# EAGLE board Masters Project (EAGLE 9.4.2)
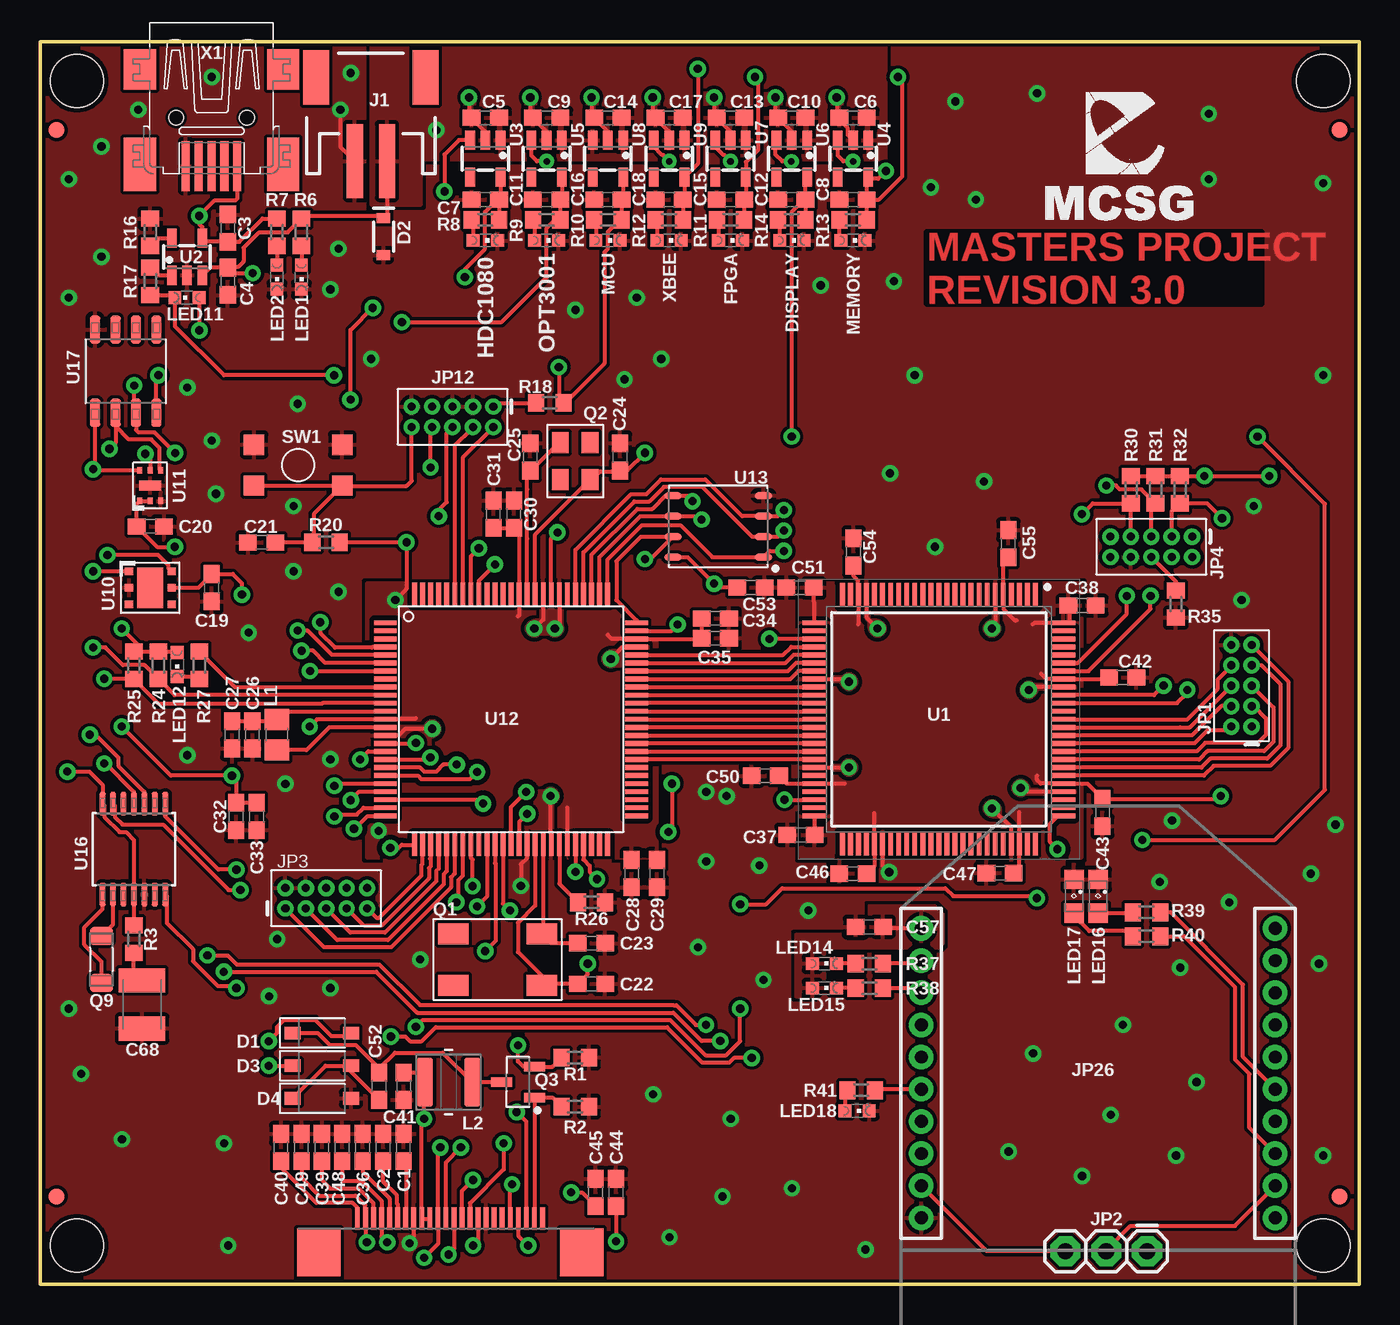
[diagram p35: board, top side]
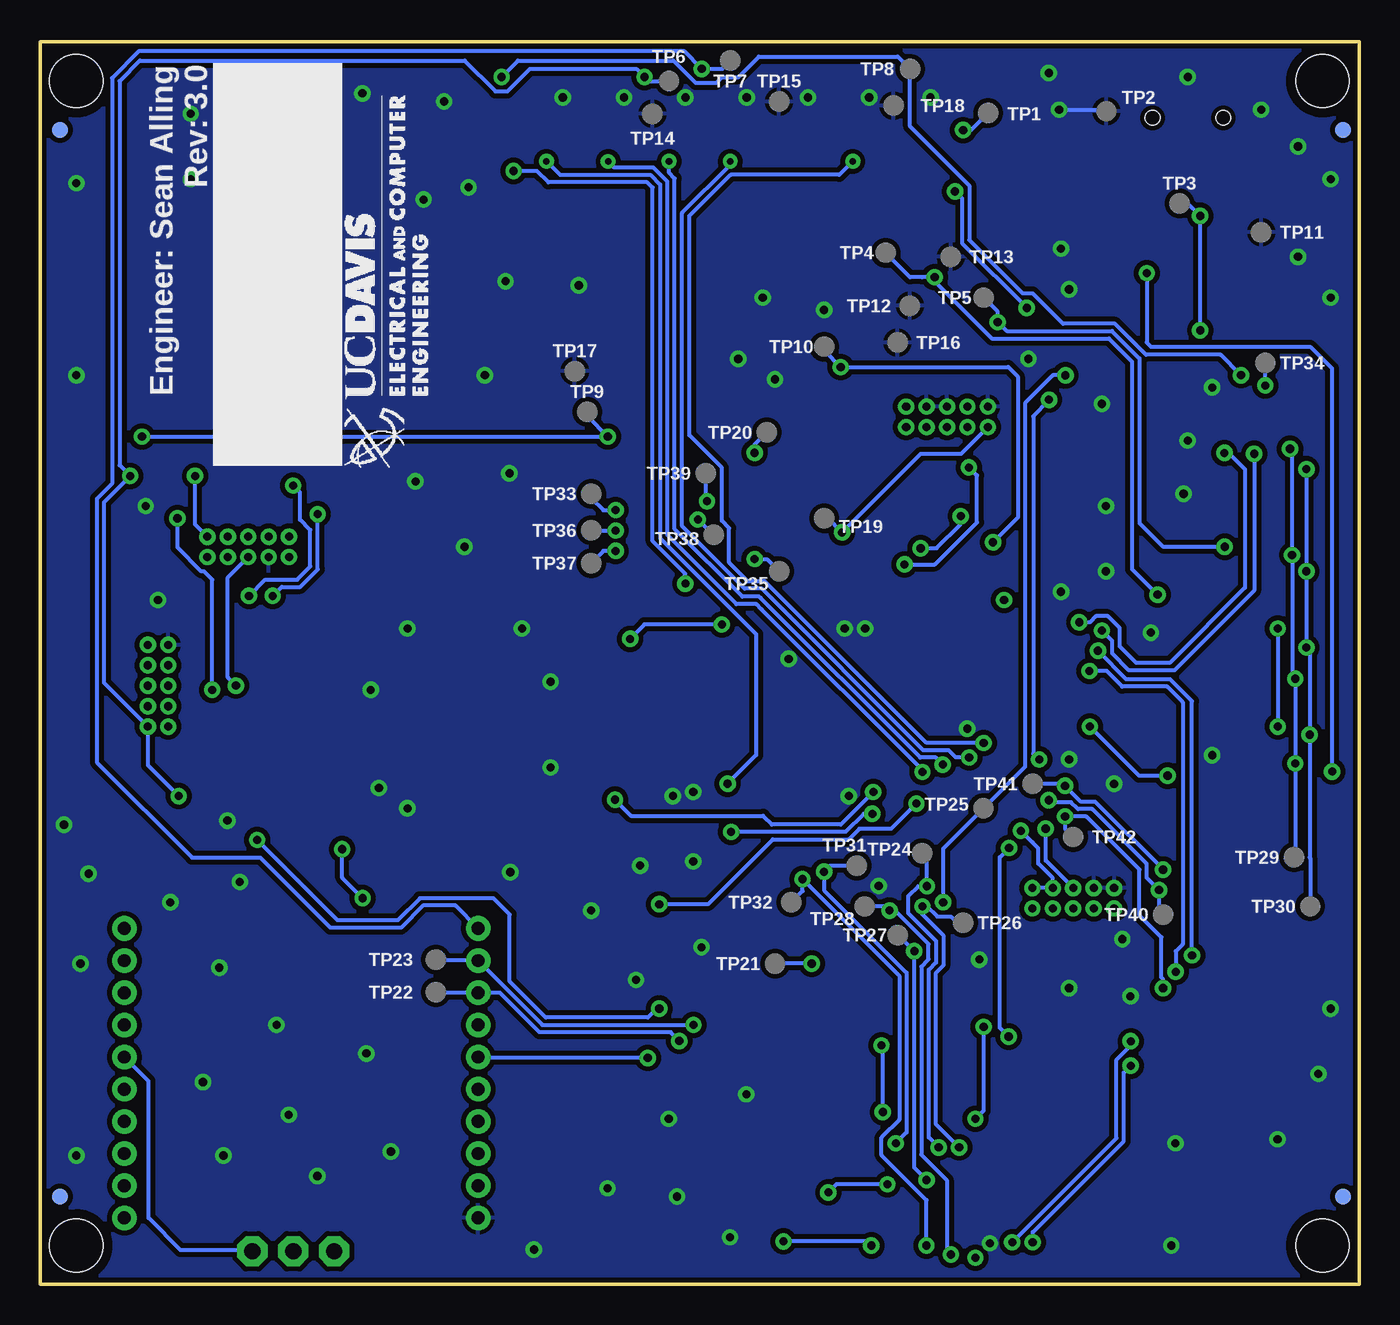
[diagram p36: board, bottom side, seen from below]

Size 82 x 77.25 mm. Coordinates in mm from the lower left corner, seen from the top.
Outline: 0,0 82,0 82,77.25 0,77.25 0,0
Copper layers (1*16): Top 0.035mm / dielectric 1.5mm / Bottom 0.035mm
Design rules "SparkFun-2-layer-STANDARD *": minimum track width 10mil, minimum drill 20mil, track to track 8mil, track to pad 8mil, pad to pad 8mil, via to via 10mil, smd to smd 8mil, copper to edge 8mil, drill to drill 8mil, minimum pad ring 10mil, minimum via ring 10mil, stop-mask expansion 4mil, vias tented up to drill 25mil, thermal gap 10mil

## Footprints (pad centres in the part's own frame; a part is rotated, then mirrored left to right if it is on the bottom)
C0603 = smd 1.1 x 1: 1 -0.85,0; 2 0.85,0
C1210K = smd 1.5 x 2.9: 1 -1.5,0; 2 1.5,0
SOD3716X128 = smd 1.004 x 0.789: 1 -1.808,0; 2 1.808,0
SOD-323 = smd 0.63 x 0.83: A 1.15,0; C -1.15,0
CHIPLED_0603 = smd 0.8 x 0.8: A 0,-0.75; C 0,0.75
FIDUCIAL-1X2 = smd 1 x 1: 1 0,0
STAND-OFF = hole 3.302: 0,0
JST-2-SMD = smd 1 x 4.6: 1 -1,-3.7; 2 1,-3.7 | smd 1.6 x 3.4: NC1 -3.4,1.5; NC2 3.4,1.5
CORTEX_DEBUG_10PIN = drill 0.508 pad 1: 1 -2.54,-0.635; 2 -2.54,0.635; 3 -1.27,-0.635; 4 -1.27,0.635; 5 0,-0.635; 6 0,0.635; 7 1.27,-0.635; 8 1.27,0.635; 9 2.54,-0.635; 10 2.54,0.635
1X3_FEMALE_HEADER_THROUGH_HOLE = drill 1.016 pad 1.88 octagon: 1 -2.54,0; 2 0,0; 3 2.54,0
XBEE-1 = drill 0.8 pad 1.524: 1 -11,20; 2 -11,18; 3 -11,16; 4 -11,14; 5 -11,12; 6 -11,10; 7 -11,8; 8 -11,6; 9 -11,4; 10 -11,2; 11 11,2; 12 11,4; 13 11,6; 14 11,8; 15 11,10; 16 11,12; 17 11,14; 18 11,16; 19 11,18; 20 11,20
L-USL0805 = smd 1.3 x 1.5: 1 -0.95,0; 2 0.95,0
LPS3015 = smd 1 x 3: 1 -1.475,0; 2 1.475,0
SML0805 = smd 1.2 x 1.2: A 1.05,0; C -1.05,0
CPFBZ-A2C4-32.768KD6 = smd 1.9 x 1.3: P$1 -2.75,1.6; P$2 2.75,1.6; P$3 2.75,-1.6; P$4 -2.75,-1.6
CRYSTAL_4-SMD = smd 1.3 x 1.05: P$1 -1.15,-0.925; P$2 1.15,-0.925; P$3 1.15,0.925; P$4 -1.15,0.925
SOT95P237X112-3 = smd 1.298 x 0.589: 1 -1.027,0.95; 2 -1.027,-0.95; 3 1.027,0
2-SMD = smd 1.11 x 1.43: 1 -1.46,0; 2 1.46,0
R0603 = smd 1 x 1.1: 1 -0.85,0; 2 0.85,0
7914G = smd 1.27 x 1.27: 1 -1.27,-2.54; 2 -1.27,2.946; 3 1.27,-2.54; 4 1.27,2.946
B1,27 = smd 1.27 x 1.27: TP 0,0
QFP50P1600X1600X160-100N = smd 1.475 x 0.3: 1 -7.738,6; 2 -7.738,5.5; 3 -7.738,5; 4 -7.738,4.5; 5 -7.738,4; 6 -7.738,3.5; 7 -7.738,3; 8 -7.738,2.5; 9 -7.738,2; 10 -7.738,1.5; 11 -7.738,1; 12 -7.738,0.5; 13 -7.738,0; 14 -7.738,-0.5; 15 -7.738,-1; 16 -7.738,-1.5; 17 -7.738,-2; 18 -7.738,-2.5; 19 -7.738,-3; 20 -7.738,-3.5; 21 -7.738,-4; 22 -7.738,-4.5; 23 -7.738,-5; 24 -7.738,-5.5; 25 -7.738,-6; 51 7.738,-6; 52 7.738,-5.5; 53 7.738,-5; 54 7.738,-4.5; 55 7.738,-4; 56 7.738,-3.5; 57 7.738,-3; 58 7.738,-2.5; 59 7.738,-2; 60 7.738,-1.5; 61 7.738,-1; 62 7.738,-0.5; 63 7.738,0; 64 7.738,0.5; 65 7.738,1; 66 7.738,1.5; 67 7.738,2; 68 7.738,2.5; 69 7.738,3; 70 7.738,3.5; 71 7.738,4; 72 7.738,4.5; 73 7.738,5; 74 7.738,5.5; 75 7.738,6 | smd 0.3 x 1.475: 26 -6,-7.738; 27 -5.5,-7.738; 28 -5,-7.738; 29 -4.5,-7.738; 30 -4,-7.738; 31 -3.5,-7.738; 32 -3,-7.738; 33 -2.5,-7.738; 34 -2,-7.738; 35 -1.5,-7.738; 36 -1,-7.738; 37 -0.5,-7.738; 38 0,-7.738; 39 0.5,-7.738; 40 1,-7.738; 41 1.5,-7.738; 42 2,-7.738; 43 2.5,-7.738; 44 3,-7.738; 45 3.5,-7.738; 46 4,-7.738; 47 4.5,-7.738; 48 5,-7.738; 49 5.5,-7.738; 50 6,-7.738; 76 6,7.738; 77 5.5,7.738; 78 5,7.738; 79 4.5,7.738; 80 4,7.738; 81 3.5,7.738; 82 3,7.738; 83 2.5,7.738; 84 2,7.738; 85 1.5,7.738; 86 1,7.738; 87 0.5,7.738; 88 0,7.738; 89 -0.5,7.738; 90 -1,7.738; 91 -1.5,7.738; 92 -2,7.738; 93 -2.5,7.738; 94 -3,7.738; 95 -3.5,7.738; 96 -4,7.738; 97 -4.5,7.738; 98 -5,7.738; 99 -5.5,7.738; 100 -6,7.738
SOT23-5L = smd 1.2 x 0.6: 1 -1.15,0.95; 2 -1.15,0; 3 -1.15,-0.95; 4 1.15,-0.95; 5 1.15,0.95
WSON-6 = smd 0.5 x 0.45: 1 -1.325,1.025; 2 -1.325,0; 3 -1.325,-1.025; 4 1.325,-1.025; 5 1.325,0; 6 1.325,1.025 | smd 1.6 x 2.5: 7 0,0
USON-6 = smd 0.35 x 0.3: 1 -0.95,0.65; 2 -0.95,0; 3 -0.95,-0.65; 4 0.95,-0.65; 5 0.95,0; 6 0.95,0.65 | smd 0.65 x 1.35: 7 0,0
LQFP100 = smd 1.4 x 0.3: 1 -7.8,6; 2 -7.8,5.5; 3 -7.8,5; 4 -7.8,4.5; 5 -7.8,4; 6 -7.8,3.5; 7 -7.8,3; 8 -7.8,2.5; 9 -7.8,2; 10 -7.8,1.5; 11 -7.8,1; 12 -7.8,0.5; 13 -7.8,0; 14 -7.8,-0.5; 15 -7.8,-1; 16 -7.8,-1.5; 17 -7.8,-2; 18 -7.8,-2.5; 19 -7.8,-3; 20 -7.8,-3.5; 21 -7.8,-4; 22 -7.8,-4.5; 23 -7.8,-5; 24 -7.8,-5.5; 25 -7.8,-6; 51 7.8,-6; 52 7.8,-5.5; 53 7.8,-5; 54 7.8,-4.5; 55 7.8,-4; 56 7.8,-3.5; 57 7.8,-3; 58 7.8,-2.5; 59 7.8,-2; 60 7.8,-1.5; 61 7.8,-1; 62 7.8,-0.5; 63 7.8,0; 64 7.8,0.5; 65 7.8,1; 66 7.8,1.5; 67 7.8,2; 68 7.8,2.5; 69 7.8,3; 70 7.8,3.5; 71 7.8,4; 72 7.8,4.5; 73 7.8,5; 74 7.8,5.5; 75 7.8,6 | smd 0.3 x 1.4: 26 -6,-7.8; 27 -5.5,-7.8; 28 -5,-7.8; 29 -4.5,-7.8; 30 -4,-7.8; 31 -3.5,-7.8; 32 -3,-7.8; 33 -2.5,-7.8; 34 -2,-7.8; 35 -1.5,-7.8; 36 -1,-7.8; 37 -0.5,-7.8; 38 0,-7.8; 39 0.5,-7.8; 40 1,-7.8; 41 1.5,-7.8; 42 2,-7.8; 43 2.5,-7.8; 44 3,-7.8; 45 3.5,-7.8; 46 4,-7.8; 47 4.5,-7.8; 48 5,-7.8; 49 5.5,-7.8; 50 6,-7.8; 76 6,7.8; 77 5.5,7.8; 78 5,7.8; 79 4.5,7.8; 80 4,7.8; 81 3.5,7.8; 82 3,7.8; 83 2.5,7.8; 84 2,7.8; 85 1.5,7.8; 86 1,7.8; 87 0.5,7.8; 88 0,7.8; 89 -0.5,7.8; 90 -1,7.8; 91 -1.5,7.8; 92 -2,7.8; 93 -2.5,7.8; 94 -3,7.8; 95 -3.5,7.8; 96 -4,7.8; 97 -4.5,7.8; 98 -5,7.8; 99 -5.5,7.8; 100 -6,7.8
SON127P600X500X60-8N = smd 1.099 x 0.442: 1 -2.815,1.905; 2 -2.815,0.635; 3 -2.815,-0.635; 4 -2.815,-1.905; 5 2.815,-1.905; 6 2.815,-0.635; 7 2.815,0.635; 8 2.815,1.905
TSSOP14 = smd 0.41 x 1.47: 1 -1.95,-2.82; 2 -1.3,-2.82; 3 -0.65,-2.82; 4 0,-2.82; 5 0.65,-2.82; 6 1.3,-2.82; 7 1.95,-2.82; 8 1.95,2.82; 9 1.3,2.82; 10 0.65,2.82; 11 0,2.82; 12 -0.65,2.82; 13 -1.3,2.82; 14 -1.95,2.82
FM24CL16B = smd 1.74 x 0.65: 1 -2.585,1.905; 2 -2.585,0.635; 3 -2.585,-0.635; 4 -2.585,-1.905; 5 2.585,-1.905; 6 2.585,-0.635; 7 2.585,0.635; 8 2.585,1.905
FPC-24PIN-0.5MM = smd 0.3 x 1.4: 1 5.75,0.75; 2 5.25,0.75; 3 4.75,0.75; 4 4.25,0.75; 5 3.75,0.75; 6 3.25,0.75; 7 2.75,0.75; 8 2.25,0.75; 9 1.75,0.75; 10 1.25,0.75; 11 0.75,0.75; 12 0.25,0.75; 13 -0.25,0.75; 14 -0.75,0.75; 15 -1.25,0.75; 16 -1.75,0.75; 17 -2.25,0.75; 18 -2.75,0.75; 19 -3.25,0.75; 20 -3.75,0.75; 21 -4.25,0.75; 22 -4.75,0.75; 23 -5.25,0.75; 24 -5.75,0.75 | smd 2.7 x 3: 51 -8.16,-1.34; 52 8.2,-1.34
32005-201 = smd 3.1 x 0.5: 1 3,1.6; 2 3,0.8; 3 3,0; 4 3,-0.8; 5 3,-1.6 | smd 2.5 x 2: M1 -3,-4.45; M2 -3,4.45 | smd 3.3 x 2: M3 2.9,4.45; M4 2.9,-4.45 | hole 0.9: 0,2.2; 0,-2.2

## Placement (x,y rotation side)
C1  1uF  [C0603]  22.59,8.51 90 top
C2  1uF  [C0603]  21.32,8.51 90 top
C3  4.7uF  [C0603]  11.67,65.66 90 top
C4  4.7uF  [C0603]  11.67,62.36 270 top
C5  1uF  [C0603]  27.67,72.52 180 top
C6  1uF  [C0603]  50.53,72.52 180 top
C7  1uF  [C0603]  27.67,67.44 180 top
C8  1uF  [C0603]  50.53,67.44 180 top
C9  1uF  [C0603]  31.48,72.52 180 top
C10  1uF  [C0603]  46.72,72.52 180 top
C11  1uF  [C0603]  31.48,67.44 180 top
C12  1uF  [C0603]  46.72,67.44 180 top
C13  1uF  [C0603]  42.91,72.52 180 top
C14  1uF  [C0603]  35.29,72.52 180 top
C15  1uF  [C0603]  42.91,67.44 180 top
C16  1uF  [C0603]  35.29,67.44 180 top
C17  1uF  [C0603]  39.1,72.52 180 top
C18  1uF  [C0603]  39.1,67.44 180 top
C19  0.1uF  [C0603]  10.65,43.31 270 top
C20  100nF  [C0603]  6.84,47.12 0 top
C21  1nF  [C0603]  13.77,46.13 180 top
C22  22pF  [C0603]  34.27,18.67 0 top
C23  22pF  [C0603]  34.27,21.21 0 top
C24  22pF  [C0603]  36.05,51.44 90 top
C25  22pF  [C0603]  30.46,51.44 90 top
C26  100nF  [C0603]  13.19,34.16 270 top
C27  4uF  [C0603]  11.92,34.16 270 top
C28  4.7uF  [C0603]  36.77,25.54 270 top
C29  100nF  [C0603]  38.33,25.54 270 top
C30  4.7uF  [C0603]  29.45,47.88 90 top
C31  100nF  [C0603]  28.18,47.88 90 top
C32  4.7uF  [C0603]  12.18,29.08 270 top
C33  100nF  [C0603]  13.45,29.08 270 top
C34  4.7uF  [C0603]  41.97,41.4 0 top
C35  100nF  [C0603]  41.97,40.17 0 top
C36  1uF  [C0603]  20.05,8.51 90 top
C37  0.1uF  [C0603]  47.29,27.95 180 top
C38  0.1uF  [C0603]  64.76,42.19 0 top
C39  1uF  [C0603]  17.51,8.51 90 top
C40  1uF  [C0603]  14.97,8.51 90 top
C41  1uF  [C0603]  22.59,12.32 270 top
C42  0.1uF  [C0603]  67.29,37.72 0 top
C43  0.1uF  [C0603]  66.04,29.34 270 top
C44  1uF  [C0603]  35.8,5.71 90 top
C45  1uF  [C0603]  34.53,5.71 90 top
C46  0.1uF  [C0603]  50.52,25.53 180 top
C47  0.1uF  [C0603]  59.66,25.56 180 top
C48  1uF  [C0603]  18.78,8.51 90 top
C49  1uF  [C0603]  16.24,8.51 90 top
C50  0.1uF  [C0603]  45.08,31.62 180 top
C51  0.1uF  [C0603]  47.23,43.31 180 top
C52  1uF  [C0603]  21.07,12.32 270 top
C53  1uF  [C0603]  44.18,43.31 0 top
C54  0.1uF  [C0603]  50.57,45.53 90 top
C55  0.1uF  [C0603]  60.19,46.04 90 top
C57  47uF  [C0603]  51.55,22.22 180 top
C68  11mF  [C1210K]  6.33,17.4 270 top
D1  SCHOTTKY  [SOD3716X128]  17.51,15.62 0 top
D2  250mA/100V  [SOD-323]  21.34,65.13 270 top
D3  SCHOTTKY  [SOD3716X128]  17.51,13.59 0 top
D4  SCHOTTKY  [SOD3716X128]  17.51,11.56 0 top
DISPLAY  GREEN  [CHIPLED_0603]  46.72,64.9 270 top
FD1  FIDUCIAL1X2  [FIDUCIAL-1X2]  1.02,5.46 0 top
FD2  FIDUCIAL1X2  [FIDUCIAL-1X2]  1.02,71.75 0 top
FD3  FIDUCIAL1X2  [FIDUCIAL-1X2]  80.77,5.46 0 top
FD4  FIDUCIAL1X2  [FIDUCIAL-1X2]  80.77,71.75 0 top
FD5  FIDUCIAL1X2  [FIDUCIAL-1X2]  1.02,5.46 0 bottom
FD6  FIDUCIAL1X2  [FIDUCIAL-1X2]  1.02,71.75 0 bottom
FD7  FIDUCIAL1X2  [FIDUCIAL-1X2]  80.77,5.46 0 bottom
FD8  FIDUCIAL1X2  [FIDUCIAL-1X2]  80.77,71.75 0 bottom
FPGA  GREEN  [CHIPLED_0603]  42.91,64.9 270 top
H1  STAND-OFF  [STAND-OFF]  2.29,74.8 0 top
H2  STAND-OFF  [STAND-OFF]  79.76,74.8 0 top
H3  STAND-OFF  [STAND-OFF]  79.76,2.41 0 top
H4  STAND-OFF  [STAND-OFF]  2.29,2.41 0 top
HDC1080  GREEN  [CHIPLED_0603]  27.67,64.9 270 top
J1  [JST-2-SMD]  20.56,73.53 0 top
JP1  2X5_HEADER1.27MM  [CORTEX_DEBUG_10PIN]  74.68,37.21 90 top
JP2  1X3_HEADER  [1X3_FEMALE_HEADER_THROUGH_HOLE]  66.27,2.06 180 top
JP3  2X5_HEADER1.27MM  [CORTEX_DEBUG_10PIN]  17.78,24 0 top
JP4  2X5_HEADER1.27MM  [CORTEX_DEBUG_10PIN]  69.07,45.85 180 top
JP12  CORTEX_DEBUG_10PIN  [CORTEX_DEBUG_10PIN]  25.63,53.93 180 top
JP26  [XBEE-1]  65.77,2.13 0 top
L1  4.7uH  [L-USL0805]  14.72,34.16 90 top
L2  100uH  [LPS3015]  25.38,12.57 180 top
LED1  GREEN  [CHIPLED_0603]  16.24,62.61 180 top
LED2  GREEN  [CHIPLED_0603]  14.72,62.61 180 top
LED11  RED  [CHIPLED_0603]  9.13,61.34 90 top
LED12  GREEN  [CHIPLED_0603]  8.51,38.54 180 top
LED14  GREEN  [CHIPLED_0603]  48.75,19.94 270 top
LED15  GREEN  [CHIPLED_0603]  48.75,18.41 270 top
LED16  GREEN  [SML0805]  65.77,24.13 270 top
LED17  GREEN  [SML0805]  64.27,24.13 270 top
LED18  GREEN  [CHIPLED_0603]  50.78,10.79 270 top
MCU  GREEN  [CHIPLED_0603]  35.29,64.9 270 top
MEMORY  GREEN  [CHIPLED_0603]  50.53,64.9 270 top
OPT3001  GREEN  [CHIPLED_0603]  31.48,64.9 270 top
Q1  CPFBZ-A2C4-32.768KD6  [CPFBZ-A2C4-32.768KD6]  28.43,20.19 180 top
Q2  ABM8-48.000MHZ-B2-T  [CRYSTAL_4-SMD]  33.26,51.18 90 top
Q3  MOSFET-NCH  [SOT95P237X112-3]  29.7,12.57 180 top
Q9  ABS07-LR  [2-SMD]  3.79,20.19 270 top
R1  0.47  [R0603]  33.26,14.1 180 top
R2  100k  [R0603]  33.26,11.05 180 top
R3  1K  [R0603]  5.83,21.46 90 top
R6  330  [R0603]  16.24,65.41 90 top
R7  330  [R0603]  14.72,65.41 90 top
R8  330  [R0603]  27.67,66.17 0 top
R9  330  [R0603]  31.48,66.17 0 top
R10  330  [R0603]  35.29,66.17 0 top
R11  330  [R0603]  42.91,66.17 0 top
R12  330  [R0603]  39.1,66.17 0 top
R13  330  [R0603]  50.53,66.17 0 top
R14  330  [R0603]  46.72,66.17 0 top
R16  2K  [R0603]  6.84,65.41 90 top
R17  330R  [R0603]  6.84,62.36 90 top
R18  1K  [R0603]  31.68,54.8 180 top
R20  1K  [R0603]  17.77,46.13 180 top
R24  10K  [R0603]  7.35,38.48 90 top
R25  10K  [R0603]  5.83,38.48 90 top
R26  91k  [R0603]  34.27,23.75 180 top
R27  1K  [R0603]  9.89,38.48 90 top
R30  5k  [R0603]  67.8,49.4 90 top
R31  5k  [R0603]  69.33,49.4 90 top
R32  5k  [R0603]  70.85,49.4 90 top
R35  2k  [R0603]  70.6,42.29 90 top
R37  1K  [R0603]  51.55,19.94 180 top
R38  1K  [R0603]  51.55,18.41 180 top
R39  1K  [R0603]  68.77,23.13 180 top
R40  1K  [R0603]  68.77,21.63 180 top
R41  1K  [R0603]  51.04,12.07 180 top
SW1  TACTILE-SWITCH-SMT  [7914G]  16.24,50.93 90 top
TP1  TPB1,27  [B1,27]  23.07,72.81 0 bottom
TP2  TPB1,27  [B1,27]  15.72,72.93 0 bottom
TP3  TPB1,27  [B1,27]  11.18,67.18 0 bottom
TP4  TPB1,27  [B1,27]  29.45,64.13 90 bottom
TP5  TPB1,27  [B1,27]  23.35,61.34 90 bottom
TP6  TPB1,27  [B1,27]  42.91,74.8 90 bottom
TP7  TPB1,27  [B1,27]  39.1,76.07 90 bottom
TP8  TPB1,27  [B1,27]  27.92,75.56 90 bottom
TP9  TPB1,27  [B1,27]  47.99,54.23 90 bottom
TP10  TPB1,27  [B1,27]  33.26,58.29 90 bottom
TP11  TPB1,27  [B1,27]  6.1,65.41 0 bottom
TP12  TPB1,27  [B1,27]  27.94,60.83 0 bottom
TP13  TPB1,27  [B1,27]  25.4,63.88 0 bottom
TP14  TPB1,27  [B1,27]  43.94,72.77 0 bottom
TP15  TPB1,27  [B1,27]  36.07,73.53 0 bottom
TP16  TPB1,27  [B1,27]  28.7,58.55 0 bottom
TP17  TPB1,27  [B1,27]  48.77,56.77 0 bottom
TP18  TPB1,27  [B1,27]  28.96,73.28 0 bottom
TP19  TPB1,27  [B1,27]  33.27,47.62 0 bottom
TP20  TPB1,27  [B1,27]  36.83,52.96 0 bottom
TP21  TPB1,27  [B1,27]  36.32,19.94 0 bottom
TP22  TPB1,27  [B1,27]  57.4,18.16 0 bottom
TP23  TPB1,27  [B1,27]  57.4,20.19 0 bottom
TP24  TPB1,27  [B1,27]  27.18,26.8 0 bottom
TP25  TPB1,27  [B1,27]  23.37,29.59 0 bottom
TP26  TPB1,27  [B1,27]  24.64,22.48 0 bottom
TP27  TPB1,27  [B1,27]  28.7,21.72 0 bottom
TP28  TPB1,27  [B1,27]  30.73,23.49 0 bottom
TP29  TPB1,27  [B1,27]  4.06,26.54 0 bottom
TP30  TPB1,27  [B1,27]  3.05,23.49 0 bottom
TP31  TPB1,27  [B1,27]  31.24,26.04 0 bottom
TP32  TPB1,27  [B1,27]  35.31,23.75 0 bottom
TP33  TPB1,27  [B1,27]  47.75,49.15 180 bottom
TP34  TPB1,27  [B1,27]  5.84,57.28 0 bottom
TP35  TPB1,27  [B1,27]  36.07,44.32 0 bottom
TP36  TPB1,27  [B1,27]  47.75,46.86 180 bottom
TP37  TPB1,27  [B1,27]  47.75,44.83 0 bottom
TP38  TPB1,27  [B1,27]  40.13,46.61 90 bottom
TP39  TPB1,27  [B1,27]  40.64,50.42 90 bottom
TP40  TPB1,27  [B1,27]  12.19,22.99 0 bottom
TP41  TPB1,27  [B1,27]  20.32,31.11 0 bottom
TP42  TPB1,27  [B1,27]  17.78,27.81 0 bottom
U1  LCMXO2-640HC-4TG100C-NEW  [QFP50P1600X1600X160-100N]  55.86,35.13 270 top
U2  MCP73831  [SOT23-5L]  9.13,63.88 90 top
U3  STLQ015M33R  [SOT23-5L]  27.67,69.98 270 top
U4  STLQ015M33R  [SOT23-5L]  50.53,69.98 270 top
U5  STLQ015M33R  [SOT23-5L]  31.48,69.98 270 top
U6  STLQ015M33R  [SOT23-5L]  46.72,69.98 270 top
U7  STLQ015M12R  [SOT23-5L]  42.91,69.98 270 top
U8  STLQ015M33R  [SOT23-5L]  35.29,69.98 270 top
U9  STLQ015M33R  [SOT23-5L]  39.1,69.98 270 top
U10  HDC1080  [WSON-6]  6.84,43.31 0 top
U11  OPT3001  [USON-6]  6.84,49.66 90 top
U12  MSP432P401R  [LQFP100]  29.27,35.13 0 top
U13  AT25SL128A  [SON127P600X500X60-8N]  42.15,47.12 180 top
U16  PCF8523  [TSSOP14]  5.83,27.05 0 top
U17  FM24CL16B  [FM24CL16B]  5.32,56.77 270 top
U18  4.2-E-INK-DISPLAY  [FPC-24PIN-0.5MM]  25.47,3.33 0 top
U$1  [UC_DAVIS_EE_1.00_INCH]  57.9,50.93 90 bottom
U$2  [UC_DAVIS_ENG]  64.77,68.71 0 top
U$3  [MCSG_SMALL]  62.48,66.17 0 top
X1  MINI-USB-32005-201  [32005-201]  10.65,72.52 270 top
XBEE  GREEN  [CHIPLED_0603]  39.1,64.9 270 top

## Tracks (layer width: path | path; a pad name or v marks a point on that pad's centre or on a via)
!FLASH_HOLD  (via drill 0.51)
  Top 0.254: U12.75 37.07,41.27 35.81,42.53 35.81,44.96 37.33,46.48 U13.7 37.94,45.09 v37.59,45.09
  Bottom 0.254: v37.59,45.09 36.83,45.09 TP35.TP
!FLASH_WP  (via drill 0.51)
  Top 0.254: v46.23,48.13 45.85,47.75 U13.3 43.63,47.75 41.35,50.03 38.59,50.03 37.68,49.12 36.74,49.12 33.27,45.65 U12.80
  Bottom 0.254: TP33.TP 47.75,48.9 46.99,48.13 v46.23,48.13
!RST  (via drill 0.51)
  Top 0.254: SW1.1 17,47.88 17,46.21 R20.2 C21.1 | JP12.10 23.09,49.95 22.77,49.63 18.81,49.63 SW1.1 | SW1.2 SW1.1 | U12.83 31.77,46.36 v32.15,46.74
  Bottom 0.254: JP12.10 24.75,51.63 27.27,51.63 v32.15,46.74 33.03,47.62 TP19.TP
!RTC_INT1  (via drill 0.51)
  Top 0.254: U16.13 4.64,29.76 4.64,29.06 5.12,28.57 7.64,28.57 11.7,24.51 v12.45,24.51 | v19.3,30.1 19.83,30.63 U12.22
  Bottom 0.254: TP40.TP 12.45,23.24 v12.45,24.51 13.21,25.27 13.21,26.15 16.6,29.54 17.49,29.54 17.92,29.97 19.18,29.97 v19.3,30.1
!RTC_INT2  (via drill 0.51)
  Top 0.254: U12.24 20.09,29.63 19.67,29.21 18.41,29.21 v18.29,29.08 | U16.7 7.87,24.13 7.87,22.48 9.51,20.84 9.51,20.08 11.05,18.54 12.06,18.54 v12.19,18.41
  Bottom 0.254: TP42.TP 18.29,28.32 v18.29,29.08 16.97,29.08 13.66,25.78 13.66,22.94 12.3,21.57 12.3,19.06 12.19,18.95 v12.19,18.41
+BAT  (via drill 0.51)
  Top 0.254: U2.3 10.55,63.21 C4.1 | C4.1 11.71,63.25 12.3,63.25 12.64,63.58 12.64,64.43 13.61,65.41 15.39,65.41 R6.2 16.41,66.42 21.2,66.42 D2.C 21.56,66.51 J1.2 | C4.1 12.01,62.87 v13.21,62.87 | v1.69,31.88 3.05,31.88 3.88,31.05 U16.14 3.99,29.76 3.99,29.06 4.93,28.12 5.33,28.12 5.83,27.63 U16.4 R3.2
  Bottom 0.254: TP1.TP 24.13,71.75 v24.62,71.75 | v1.69,31.88 1.69,56.93 3.05,58.29 12.95,58.29 13.21,58.55 v13.21,62.87
  pour Top: 20.58,79.12 20.58,67.13 23.67,67.13 23.67,69.93 52.56,69.95 52.58,79.12
ASSOCIATE_LED
  Top 0.254: R39.1 70.27,23.13 74.77,18.63 74.77,14.13 JP26.15
CHARGE_STATUS  (via drill 0.51)
  Top 0.254: R17.1 8.21,61.51 LED11.C 8.38,59.55 11.42,56.51 v18.27,56.51 | v25.86,23.75 25.99,23.88 25.99,25.12 26.27,25.4 U12.32
  Bottom 0.254: v18.27,56.51 19.04,56.51 20.78,54.77 20.78,33 20.78,32.18 TP25.TP 25.86,27.09 v25.86,23.75
DISPLAY_D/!C  (via drill 0.51)
  Top 0.254: U12.36 28.27,26.2 28.31,26.15 28.31,21.36 v27.66,20.71 | U18.11 26.22,5.8 v26.9,6.48
  Bottom 0.254: v26.9,6.48 27.68,7.26 27.68,20.69 v27.66,20.71 28.67,21.72 TP27.TP
EINK_!RST  (via drill 0.51)
  Top 0.254: U12.46 v33.27,25.64 | U18.10 26.72,5.04 28.81,7.14 v28.81,8.76
  Bottom 0.254: v28.81,8.76 28.14,9.44 28.14,19.37 33.27,24.5 v33.27,25.64 32.88,26.04 TP31.TP
EINK_BUSY  (via drill 0.51)
  Top 0.254: U18.9 27.22,2.72 v26.91,2.41 | U12.47 33.77,26.4 34.16,26.01 34.16,25.64 v34.61,25.19
  Bottom 0.254: v26.91,2.41 26.91,5.23 29.7,8.03 29.7,9.13 28.6,10.24 28.6,19.18 v34.61,25.19 34.61,24.44 TP32.TP
FPGA_DONE  (via drill 0.51)
  Top 0.254: v27.53,29.89 27.29,30.13 U12.23 | v43.52,23.63 45.12,23.63 46.12,24.63 56.27,24.63 56.76,24.14 61.96,24.14 v61.96,24 | U1.76 63.27,29.13 62.77,28.63 62.77,27.51 v63.23,27.05
  Bottom 0.254: v27.53,29.89 29.1,28.32 31.09,28.32 31.74,27.67 36.45,27.67 40.49,23.63 v43.52,23.63 | v61.96,24 63.23,25.27 v63.23,27.05
FRAM_WP  (via drill 0.51)
  Top 0.254: v5.84,55.88 5.84,54.3 U17.7 5.95,53.12 6.1,52.97 7.09,52.97 v8.38,51.68 | v17.41,41.16 17.43,41.13 17.43,40.47 18.32,39.58 20.61,39.58 20.63,39.61 21.45,39.61 U12.4
  Bottom 0.254: v5.84,55.88 TP34.TP | v8.38,51.68 8.12,51.68 7.11,50.67 7.11,43.31 11.79,38.63 13.86,38.63 14.9,39.66 14.9,40.8 15.64,41.53 16.37,41.53 16.75,41.16 v17.41,41.16
FREQ_HF  (via drill 0.51)
  Top 0.254: U12.85 30.77,46.62 Q2.P$1 34.24,49.97 34.81,50.54 35.54,50.54 35.59,50.59 C24.1 36.49,50.59 v37.59,51.69
  Bottom 0.254: v37.59,51.69 37.59,52.2 TP20.TP
FREQ_LF  (via drill 0.51)
  Top 0.254: U12.41 30.77,23.55 29.7,22.48 29.7,20.66 31.18,19.18 Q1.P$1 31.26,18.67 C22.1 34.04,19.28 v34.04,19.94
  Bottom 0.254: v34.04,19.94 TP21.TP
GDR
  Top 0.254: R2.2 31.83,11.62 Q3.1 U18.2
GND  (via drill 0.51)
  Top 0.254: v38.08,73.79 38.08,72.68 C17.2 39.1,71.67 U9.2 | U3.2 27.67,71.67 C5.2 26.65,72.68 v26.65,73.79 | U5.2 31.48,71.67 C9.2 30.46,72.68 v30.46,73.79 | U8.2 35.29,71.67 C14.2 34.27,72.68 v34.27,73.79 | U7.2 42.91,71.67 C13.2 41.89,72.68 v41.89,73.79 | U6.2 46.72,71.67 C10.2 45.7,72.68 v45.7,73.79 | v49.51,73.79 49.51,72.68 C6.2 49.68,72.39 50.21,71.86 50.21,71.45 U4.2 | J1.1 18.66,70.73 v18.66,73.02 | U1.56 52.36,26.04 v52.78,25.63 | U1.22 51.36,41.46 v52.05,40.77 | v59.17,40.77 59.36,40.97 U1.6 | U1.92 61.62,37.13 v61.45,36.96 | U1.79 63.58,30.61 61.2,30.61 v60.94,30.86 | U1.72 60.36,28.39 v59.17,29.59 | U1.44 v50.28,32.13 | U1.33 50.11,37.63 v50.28,37.47 | v52.78,25.63 | U12.43 31.75,27.35 31.75,28.16 31.73,28.18 v31.73,30.35 | U12.40 30.25,27.31 30.25,26.49 29.88,26.12 v29.88,24.77 | U12.84 31.27,41.32 v30.72,40.77 | U12.82 32.27,41.05 v31.99,40.77 | v35.47,38.88 36.21,39.63 U12.72 | U12.15 21.49,34.15 22.31,34.15 22.7,34.54 v24.37,34.54 | U18.17 23.22,2.81 v22.96,2.55
  Bottom 0.254: v18.66,73.02 15.82,73.02 TP2.TP
  other vias: 53.07,62.36 54.36,56.52 52.83,50.42 58.67,49.91 55.63,45.85 38.61,57.53 37.08,61.34 36.32,56.26 48.51,62.1 55.37,68.2 58.17,67.44 56.9,73.53 61.98,74.04 72.64,72.77 72.64,68.71 79.76,56.52 79.76,68.45 75.44,48.39 74.68,42.55 70.36,28.83 78.99,25.53 80.52,28.57 73.91,23.75 69.6,25.02 61.72,14.35 60.2,8.26 70.61,8 66.55,10.54 70.87,19.68 79.5,19.94 79.76,8 51.31,2.16 46.74,5.97 38.1,11.81 39.12,2.92 42.93,10.29 11.68,2.41 11.43,8.76 5.08,9.02 2.54,13.08 1.78,17.14 18.03,18.41 14.22,17.91 12.95,40.51 18.54,43.05 15.75,44.32 10.92,49.15 10.67,52.45 9.14,55.75 16,54.74 15.75,48.39 1.78,61.34 3.81,63.88 1.78,68.71 3.81,70.74 18.54,64.39 18.03,61.85 33.27,60.58 20.57,57.53 19.3,75.31 10.67,75.06 6.1,73.02 40.89,20.95 47.75,23.24 44.96,18.92 41.4,26.29 44.7,26.04 41.4,30.61 42.67,30.35 42.42,5.46 64.77,6.73 67.31,16.13 71.88,12.57 23.62,20.19 14.73,21.46 15.24,31.11 18.03,32.64 9.14,32.89
  pour Bottom (isolate 0.305): -7.37,79.91 -7.37,-3.16 83.04,-3.16 83.04,80.15
  pour Top (rank 2): -7.13,79.88 -7.13,-0.89 83.55,-0.89 83.57,79.88
INTERRUPT_OPT3001  (via drill 0.51)
  Top 0.254: v6.53,51.63 6.84,51.32 U11.5 | v16,40.64 16.62,40.64 18.13,39.13 U12.5
  Bottom 0.254: v6.53,51.63 6.53,43.13 11.49,38.17 14.31,38.17 15.36,39.22 15.36,40 v16,40.64
MCU_EN_CTL3  (via drill 0.41, 0.51)
  Top 0.254: v25.89,32.31 25.06,32.31 24.62,31.87 23.88,31.87 23.62,32.13 U12.19 | v42.91,69.82 42.53,70.2 42.47,70.2 41.96,70.71 U7.3
  Bottom 0.254: v25.89,32.31 26.32,32.74 27.29,32.74 37.22,42.67 37.29,42.75 38.35,42.75 42.55,46.95 42.55,68.74 42.91,69.1 v42.91,69.82
MCU_EN_CTL4  (via drill 0.41, 0.51)
  Top 0.254: U12.18 24.12,32.63 v24.25,32.76 | v39.1,69.82 38.72,70.2 38.66,70.2 38.15,70.71 U9.3
  Bottom 0.254: v24.25,32.76 25.08,32.76 25.52,33.2 27.1,33.2 37.15,43.25 38.2,43.25 42.1,47.14 42.1,66.61 39.1,69.61 v39.1,69.82
MCU_EN_CTL5  (via drill 0.41, 0.51)
  Top 0.254: v30.27,29.25 29.77,28.75 U12.39 | v39.27,31.13 39.27,28.35 v39.05,28.13 | v50.53,69.82 49.93,69.82 49.58,70.16 U4.3
  Bottom 0.254: v30.27,29.25 30.8,29.25 31.93,28.13 v39.05,28.13 | v39.27,31.13 37.49,32.91 37.49,40.42 43.47,46.39 43.47,68.36 44.07,68.97 49.68,68.97 v50.53,69.82
MCU_EN_CTL6  (via drill 0.41, 0.51)
  Top 0.254: U12.20 23.48,31.63 23.69,31.41 26.72,31.41 v27.16,31.85 | v46.7,69.81 46.13,69.81 45.7,70.23 45.7,71.06 U6.3
  Bottom 0.254: v27.16,31.85 27.16,31.97 37.16,41.96 37.48,42.29 38.72,42.29 43.01,46.58 43.01,68.55 43.88,69.43 46.31,69.43 v46.7,69.81
MCU_FPGA_1  (via drill 0.51)
  Top 0.254: U1.28 v45.33,40.13 | U12.74 39.23,40.63 v39.62,41.02
  Bottom 0.254: v39.62,41.02 44.43,41.02 v45.33,40.13
MCU_FPGA_2
  Top 0.254: U1.29 46.69,39.63 46.19,39.13 U12.71
MCU_FPGA_3
  Top 0.254: U12.70 46.34,38.63 46.84,39.13 U1.30
MCU_FPGA_4
  Top 0.254: U1.31 46.98,38.63 46.48,38.13 U12.69
MCU_FPGA_5
  Top 0.254: U12.68 46.63,37.63 47.13,38.13 U1.32
MCU_FPGA_6
  Top 0.254: U12.67 U1.34
MCU_FPGA_7
  Top 0.254: U12.66 U1.35
MCU_FPGA_8
  Top 0.254: U1.36 U12.65
MCU_FPGA_9
  Top 0.254: U12.64 U1.37
MCU_FPGA_10
  Top 0.254: U12.63 U1.38
MCU_FPGA_11
  Top 0.254: U1.39 U12.62
MCU_FPGA_12
  Top 0.254: U12.61 U1.40
MCU_FPGA_13
  Top 0.254: U1.41 U12.60
MCU_FPGA_14
  Top 0.254: U12.59 U1.42
MCU_FPGA_15
  Top 0.254: U1.43 U12.58
MCU_SCL  (via drill 0.51)
  Top 0.254: U12.11 17.55,36.13 17.54,36.12 7.34,36.12 R25.1 3.99,37.63 v3.98,37.65 | 4.68,53.34 U17.6 | 4.68,53.34 4.68,52.32 v4.3,51.94 | U10.6 7.97,44.53 7.97,44.69 7.33,45.34 v4.17,45.34 | U11.4 7.42,50.68 7.42,52 6.9,52.52 5.51,52.52 4.68,53.34 | U16.11 5.83,30.62 4.06,32.39 v3.98,32.39
  Bottom 0.254: v4.3,51.94 4.17,51.82 v4.17,45.34 4.17,37.85 v3.98,37.65 v3.98,32.39 3.98,26.63 TP29.TP
MCU_SD_HDC1080  (via drill 0.51)
  Top 0.254: v25.13,67.94 25.13,70.23 26.03,71.13 U3.3 | v19.89,32.63 20.39,33.13 U12.17 | v19.29,54.99 19.29,59.32 v20.67,60.71
  Bottom 0.254: v19.89,32.63 20.27,33 20.27,53.98 19.29,54.96 v19.29,54.99 | v25.13,67.94 24.7,67.51 24.7,64.73 v20.67,60.71
MCU_SD_OPT3001  (via drill 0.41, 0.51)
  Top 0.254: U12.16 23.32,33.63 v23.35,33.66 | v31.48,69.82 30.88,69.82 30.53,70.16 U5.3
  Bottom 0.254: v23.35,33.66 26.91,33.66 36.96,43.7 37.99,43.7 39.17,44.88 39.17,47.01 39.62,47.47 39.62,50.77 41.64,52.78 41.64,66.42 39.08,68.98 32.32,68.98 v31.48,69.82
MCU_SDA  (via drill 0.51)
  Top 0.254: U11.6 3.35,50.61 v3.29,50.67 3.41,50.8 U17.5 | U10.1 5.51,44.32 v3.29,44.32 | U12.10 8.35,36.63 R24.1 6.48,38.5 5.14,38.5 4.05,39.59 v3.29,39.59 | v3.09,34.16 3.45,34.16 4.86,32.75 4.86,32.23 6.48,30.62 U16.10
  Bottom 0.254: v3.29,50.67 v3.29,44.32 v3.29,39.59 3.09,39.39 v3.09,34.16 3.09,26.55 3.05,26.51 TP30.TP
MCU_SPI_CLK  (via drill 0.51)
  Top 0.254: U12.77 34.77,45.21 37.31,47.75 U13.6 40.91,47.75 v41.12,47.54
  Bottom 0.254: v41.12,47.54 40.18,46.61 TP38.TP
MCU_SPI_CS  (via drill 0.51)
  Top 0.254: U12.76 35.27,45.07 37.41,47.2 39.79,47.2 41.78,45.21 U13.1 45.34,45.59 v46.23,45.59
  Bottom 0.254: v46.23,45.59 46.99,45.59 TP37.TP
MCU_SPI_MISO  (via drill 0.51)
  Top 0.254: v46.23,46.86 45.85,46.48 U13.2 44.25,46.48 41.16,49.57 38.78,49.57 37.87,48.67 36.93,48.67 33.77,45.51 U12.79
  Bottom 0.254: TP36.TP v46.23,46.86
MCU_SPI_MOSI  (via drill 0.51)
  Top 0.254: v40.55,48.68 40.22,49.02 U13.5 38.87,49.02 38.06,48.21 37.12,48.21 34.27,45.36 U12.78
  Bottom 0.254: v40.55,48.68 40.64,48.77 TP39.TP
N$1
  Top 0.254: JP12.1 28.41,54.8 R18.2
N$4
  Top 0.254: U12.9 12.09,37.13 R27.2
N$5
  Top 0.254: R17.2 7.32,62.73 U2.1
N$7
  Top 0.254: R38.2 LED15.C
N$8
  Top 0.254: R37.2 LED14.C
N$9
  Top 0.254: LED12.C 9.74,37.79 R27.1
N$14
  Top 0.254: LED16.A 67.87,23.08 R39.2
N$15
  Top 0.254: R41.2 50.03,11.91 LED18.A
N$16
  Top 0.254: LED17.A 64.27,22.91 65.21,21.97 67.54,21.97 67.88,21.63 R40.2
N$17
  Top 0.254: R16.1 7.32,65.03 U2.5
N$18
  Top 0.254: U12.44 32.27,24.9 R26.2
N$19
  Top 0.254: L1.1 16.56,33.21 17.97,34.63 U12.14
N$51
  Top 0.254: C27.1 C26.1 14.62,35.01 L1.2 15.23,35.63 U12.12
N$58
  Top 0.254: Q9.2 3.79,20.06 2.75,21.11 2.75,22.2 3.88,23.33 U16.1
N$59
  Top 0.254: Q9.1 4.53,22.38 U16.2
N$132
  Top 0.254: JP12.2 26.27,51.39 U12.94
N$133  (via drill 0.51)
  Top 0.254: U12.93 26.77,45.26 v27.27,45.76 | v24.77,47.75 24.77,48.13 25.27,48.63 25.27,52.93 JP12.6
  Bottom 0.254: v27.27,45.76 26.27,45.76 24.77,47.27 v24.77,47.75
N$134  (via drill 0.51)
  Top 0.254: U12.92 27.27,43.75 v28.27,44.75 | v24.27,50.78 24.27,53.2 JP12.8
  Bottom 0.254: v24.27,50.78 23.77,50.28 23.77,47.37 26.39,44.75 v28.27,44.75
N$135
  Top 0.254: 31.31,21.65 31.75,21.21 C23.1 | Q1.P$4 31.32,21.65 31.31,21.65 | 31.31,21.65 31.23,21.73 31.27,21.76 U12.42
N$138
  Top 0.254: JP12.4 26.77,53.16 26.77,53.13 25.77,52.13 U12.95
N$140
  Top 0.254: 30.49,50.56 32.23,52.3 32.36,52.3 Q2.P$3 | C25.1 30.27,50.39 30.27,49.42 30.28,49.42 30.28,46.34 30.27,46.33 U12.86 | 30.49,50.56 | 30.49,50.56 C25.1 | C25.1
N$164
  Top 0.254: R6.1 LED1.A
N$165
  Top 0.254: R7.1 LED2.A
N$166
  Top 0.254: R8.1 26.92,66.07 HDC1080.A
N$167
  Top 0.254: R9.1 30.73,66.07 OPT3001.A
N$168
  Top 0.254: R10.1 34.54,66.07 MCU.A
N$169
  Top 0.254: R11.1 42.16,66.07 FPGA.A
N$171
  Top 0.254: R14.1 45.97,66.07 DISPLAY.A
N$172
  Top 0.254: MEMORY.A 49.68,65 R13.1
N$173
  Top 0.254: R12.1 38.35,66.07 XBEE.A
P7.5
  Top 0.254: 23.78,26.64 23.77,26.65 U12.27 23.77,26.13 23.71,26.07 23.71,25.43 21.06,22.78 20.9,22.78 JP3.9
P7.6
  Top 0.254: U12.28 24.27,26.49 | 24.23,26.45 24.27,26.49 | 24.27,26.49 24.27,25.98 24.16,25.88 24.16,25.24 21.25,22.33 20.09,22.33 JP3.7
P7.7
  Top 0.254: U12.29 24.77,25.84 24.62,25.69 24.62,25.05 21.43,21.87 19.28,21.87 JP3.5
P8.0
  Top 0.254: U12.30 25.27,25.69 25.08,25.5 25.08,24.86 21.62,21.41 18.47,21.41 JP3.3
P8.1
  Top 0.254: U12.31 25.77,25.54 25.54,25.31 25.54,24.68 21.81,20.95 17.65,20.95 JP3.1
P10.5  (via drill 0.51)
  Top 0.254: U12.25 21.43,29.08 20.32,29.08 19.56,28.32 v19.49,28.32
  Bottom 0.254: JP3.6 19.49,26.35 v19.49,28.32
PREVGH  (via drill 0.51)
  Top 0.254: v21.57,2.62 21.22,2.97 U18.21 21.22,5.19 19.98,6.43 18.83,6.43 18.78,6.48 C48.1 | D1.2 19.13,15.44 18.09,15.44 17.09,16.43 15.15,16.43 14.72,16 14.72,15.62 v14.21,15.11
  Bottom 0.254: v21.57,2.62 15.1,9.09 15.1,13.96 14.21,14.85 v14.21,15.11
PREVGL  (via drill 0.51)
  Top 0.254: v20.3,2.62 20.22,2.7 U18.23 20.2,4.1 20.2,4.91 19.6,5.51 17.34,5.51 16.24,6.62 C49.1 | v14.21,13.59 D3.1
  Bottom 0.254: v20.3,2.62 20.3,3.24 14.64,8.9 14.64,13.16 v14.21,13.59
PT9A
  Top 0.254: JP1.8 74.04,38.43 73.2,37.6 73.2,37.02 71.31,35.13 U1.88
PT9B
  Top 0.254: JP1.6 71.46,34.63 70.87,34.63 U1.87
PT9C
  Top 0.254: JP1.4 73.42,35.94 71.6,34.13 U1.86
PT9D
  Top 0.254: JP1.2 73.79,34.42 72.54,34.42 71.75,33.63 U1.85
PT10A
  Top 0.254: JP1.3 75.44,35.94 76.2,35.18 76.2,34.16 75.69,33.66 72.42,33.66 71.9,33.13 U1.84
PT10B
  Top 0.254: JP1.5 76.66,35.87 76.66,33.72 76.08,33.15 72.56,33.15 72.04,32.63 U1.83
PT10C
  Top 0.254: JP1.7 75.93,38.48 77.11,37.3 77.11,33.53 76.27,32.69 72.75,32.69 72.19,32.13 U1.82
PT10D
  Top 0.254: JP1.9 77.57,37.49 77.57,33.34 76.46,32.23 72.94,32.23 72.34,31.63 U1.81
RESE  (via drill 0.51)
  Top 0.254: R1.2 31.83,13.52 Q3.2 30.04,13.52 29.7,13.86 v29.7,14.86 | v29.62,10.71 30.22,10.11 U18.3
  Bottom 0.254: v29.62,10.71 29.62,14.78 v29.7,14.86
RSSI
  Top 0.254: R41.1 51.95,12.13 JP26.6
RTC_CLKOUT  (via drill 0.51)
  Top 0.254: U16.8 7.78,29.08 11.08,25.78 v12.19,25.78 | v18.29,30.99 18.43,31.13 U12.21
  Bottom 0.254: TP41.TP 18.41,31.11 v18.29,30.99 17.3,30 16.41,30 v12.19,25.78
RTC_VCAP
  Top 0.254: C68.1 5.83,19.41 R3.1
SPI_CLK  (via drill 0.51)
  Top 0.254: U18.13 25.22,7.58 v26.15,8.51 | v26.88,24.75 26.88,26.4 26.79,26.49 26.79,27.31 U12.33
  Bottom 0.254: v26.15,8.51 26.77,9.13 26.77,19.56 26.32,20.01 26.32,21.34 28.05,23.08 28.05,24.12 27.42,24.75 v26.88,24.75 26.88,26.5 TP24.TP
SPI_CS_DISPLAY  (via drill 0.51)
  Top 0.254: U18.12 25.72,2.19 v25.38,1.85 | U12.37 28.77,23.67 v29.2,23.24
  Bottom 0.254: v25.38,1.85 25.64,2.11 25.64,6.48 27.23,8.06 27.23,19.75 26.77,20.2 26.77,21.15 28.86,23.24 v29.2,23.24 29.46,23.49 TP28.TP
SPI_CS_FPGA  (via drill 0.51)
  Top 0.254: U12.38 29.27,29.67 v30.21,30.61 | v46.27,30.13 U1.48
  Bottom 0.254: v30.21,30.61 32.23,28.58 36.52,28.58 37.07,29.13 45.27,29.13 v46.27,30.13
SPI_MOSI  (via drill 0.51)
  Top 0.254: v23.86,1.65 24.72,2.51 U18.14 24.72,8.35 v24.88,8.51 | U12.35 27.77,24.1 v27.16,23.49
  Bottom 0.254: v24.88,8.51 26.31,9.95 26.31,19.37 25.86,19.82 25.86,21.71 27.16,23.01 v27.16,23.49 26.87,23.49 26.23,22.86 25.4,22.86 25.02,22.48 TP26.TP
STATUS_LED
  Top 0.254: JP26.13 75.17,9.73 75.17,13.08 74.27,13.98 74.27,18.48 71.11,21.63 R40.1
SW
  Top 0.254: Q3.3 L2.1 25.03,14.4 22.05,14.4 21.07,13.42 C52.1 21.07,13.42 19.63,14.86 18.02,14.86 17.26,15.62 D1.1
SWGL
  Top 0.254: D4.1 17.73,13.59 D3.2 19.32,13.22 C52.2
TCK  (via drill 0.51)
  Top 0.254: v69.83,37.22 69.24,36.63 U1.91 | JP4.6 70.6,43.69 R35.2
  Bottom 0.254: v69.83,37.22 70.34,37.73 70.34,43.94 JP4.6
TDI  (via drill 0.51)
  Top 0.254: JP4.5 69.07,48.3 R31.1 68.46,49.42 67.11,49.42 66.88,49.66 v66.28,49.66 | v69.02,42.8 69.02,41.99 65.16,38.13 U1.94
  Bottom 0.254: v69.02,42.8 68,43.82 66.02,43.82 65.21,44.63 65.21,46.9 65.85,47.53 65.85,49.23 v66.28,49.66
TDO  (via drill 0.51)
  Top 0.254: U1.95 64.5,38.63 67.55,41.68 v67.55,42.8 | JP4.7 R30.1 65.43,48.55 v64.75,47.88
  Bottom 0.254: v67.55,42.8 66.99,43.36 65.83,43.36 64.75,44.44 v64.75,47.88
TMS  (via drill 0.51)
  Top 0.254: U1.90 70.66,36.13 71.31,36.77 v71.31,36.96 | JP4.3 70.34,48.05 R32.1 72.54,48.55 v73.47,47.62
  Bottom 0.254: v71.31,36.96 71.31,43.82 71.81,44.32 71.98,44.32 73.47,45.81 v73.47,47.62
UART_RX_XBEE  (via drill 0.51)
  Top 0.254: JP26.2 54.58,19.94 R37.1 | v16.25,39.39 16.95,39.39 17.71,38.63 U12.6 | v41.39,16.13 40.76,16.13 39.54,17.35 39.37,17.35 39.35,17.36 23.61,17.36 21.08,19.89 12.21,19.89 11.65,20.45 v10.4,20.45
  Bottom 0.254: v16.25,39.39 14.47,37.61 11.75,37.61 10.4,36.26 v10.4,20.45 | v41.39,16.13 50.77,16.13 JP26.2 57.34,20.13 TP23.TP
UART_TX_XBEE  (via drill 0.51)
  Top 0.254: v16.77,38.13 U12.7 | R38.1 54.48,18.41 JP26.3 | v42.27,15.13 41.12,15.13 39.35,16.89 23.43,16.89 20.89,19.43 v11.41,19.43
  Bottom 0.254: v16.77,38.13 15.71,38.13 14.73,37.16 11.94,37.16 10.98,36.2 10.98,21.14 11.41,20.7 v11.41,19.43 | v42.27,15.13 42.81,15.67 50.96,15.67 53.42,18.13 JP26.3 57.37,18.13 TP22.TP
VCC_DISPLAY  (via drill 0.51)
  Top 0.254: C12.1 47.57,68.83 U6.5 | C12.1 R14.2 | C12.1 47.48,67.44 46.72,66.67 v46.72,52.71 | v68.52,27.63 76.76,27.63 79.87,30.73 79.87,48.51 v75.68,52.71 | U18.15 U18.16 23.72,10.15 v23.86,10.29 23.86,12.52 L2.2 23.31,13.17 C41.1 | v23.35,16 23.78,16.43 39.16,16.43 41.36,14.24 42.64,14.24 43.51,15.11 v43.51,17.14
  Bottom 0.254: v68.52,27.63 63.52,22.63 59.77,22.63 58.39,24 53.83,24 52.82,22.99 52.82,18.82 50.58,16.59 44.23,16.59 43.67,17.14 v43.51,17.14 | v23.35,16 23.35,10.79 v23.86,10.29 | v75.68,52.71 v46.72,52.71 47.99,53.98 TP9.TP
VCC_FPGA  (via drill 0.51)
  Top 0.254: R11.2 C15.1 43.86,67.44 U7.5 43.86,69.76 44.64,70.54 44.64,74.85 v44.43,75.06 | C54.1 50.57,44.02 50.84,43.74 50.84,42.89 U1.23 50.86,41.02 | C55.1 59.86,44.87 U1.5 59.88,42.85 59.88,41.99 60.6,41.28 60.69,41.28 | C38.1 63.99,42.11 63.99,41.13 U1.100 61.81,41.13 61.71,41.02 | C46.1 51.86,26.02 U1.55 51.84,27.39 51.84,29.29 | U1.50 48.14,29.11 C37.1 | C50.1 46.42,31.13 U1.46 50.02,31.13 | U1.26 48.13,42.41 48.08,42.46 48.08,43.05 | C47.1 60.86,25.91 U1.73 60.86,29.34 | R30.2 R31.2 R32.2 v72.37,50.25 v76.41,50.25 | C42.1 66.35,37.63 U1.93 62.56,37.63 62.21,37.97 | v73.39,30.35 73.38,30.36 73.2,30.19 C43.1 65.1,31.13 U1.80 62.2,31.13 61.96,31.37 61.96,31.62
  Bottom 0.254: JP4.1 72.37,47.24 v72.37,50.25 | TP6.TP 44.18,74.8 v44.43,75.06 44.94,75.56 51.56,75.56 52.96,74.17 53.7,74.17 55.61,76.07 75.8,76.07 77.07,74.8 77.07,50.92 v76.41,50.25 78.03,48.63 78.03,37.39 JP1.1 75.31,32.27 v73.39,30.35
  pour Top (isolate 0.305): 47.23,43.56 47.23,26.54 64.75,26.54 64.75,43.56
VCC_HDC1080  (via drill 0.51)
  Top 0.254: v12.54,42.87 v12.53,42.88 12.53,43.59 11.96,44.16 C19.1 10.68,44.18 10.72,44.18 9.84,43.31 U10.5 | U3.5 28.62,67.44 C7.1 | C7.1 R8.2 | 26.4,63.11 27.65,64.36 27.65,66.66 28.43,67.44 C7.1 | v26.4,62.61 26.4,63.11 | 26.4,63.11
  Bottom 0.254: v12.54,42.87 14.13,44.46 14.13,57.36 15.57,58.8 22.84,58.8 26.4,62.36 v26.4,62.61 27.18,62.61 27.92,62.61 TP4.TP
VCC_MCU  (via drill 0.51)
  Top 0.254: 35.27,40.38 35.52,40.13 U12.73 41.08,40.13 C35.1 C34.1 | R20.1 v22.77,46.13 22.77,43.23 v22.08,42.55 | U8.5 36.24,67.54 C16.1 36.14,66.26 | 36.14,66.26 R10.2 | U12.45 32.77,29.63 | LED12.A 8.46,39.33 R24.2 R25.2 6.08,39.59 6.08,39.75 v5.06,40.77 | v16.75,34.67 17.2,35.13 U12.13 21.49,35.15 22.31,35.15 22.34,35.18 23.35,35.18 | v5.06,34.67 8.11,31.62 v11.92,31.62 12.18,31.62 C32.1 C33.1 | v32.24,57.02 32.24,55.09 R18.1 32.63,54.8 35.07,57.24 35.07,64.16 35.27,64.36 35.27,65.39 36.14,66.26 | 29.7,41.53 29.77,41.6 U12.87 29.77,46.71 C30.1 C31.1
  Bottom 0.254: v22.77,46.13 21.23,47.66 21.23,56.43 21.83,57.02 v32.24,57.02 33.26,58.04 TP10.TP | v16.75,34.67 13.7,31.62 v11.92,31.62 | v5.06,40.77 v5.06,34.67 | 20.32,27.47 v21.04,28.19 19.95,27.1 19.95,26.16 19.05,25.26 JP3.8 JP3.10
  pour Top (isolate 0.305): 20.3,43.56 20.3,26.54 38.34,26.54 38.34,43.56
VCC_MEMORY  (via drill 0.51)
  Top 0.254: C8.1 51.38,68.73 | 51.38,68.73 U4.5 | C8.1 52.14,67.44 53.58,68.87 53.58,74.8 v53.32,75.06 | U17.8 7.22,56.39 v7.35,56.52 | R13.2 C8.1 | U13.8 40.24,45.21 v41.89,43.56 42.15,43.31 C53.1 | v52.58,69.21 52.09,68.73 51.38,68.73
  Bottom 0.254: v7.35,56.52 8.62,57.79 13.26,57.79 15.19,59.72 18.42,59.72 20.3,61.6 20.91,61.6 24.24,64.92 24.24,68.31 27.92,72 TP8.TP 28.69,76.33 37.32,76.33 38.59,75.06 39.62,75.06 40,74.68 41.25,74.68 42.64,76.07 52.31,76.07 v53.32,75.06 | v41.89,43.56 41.91,43.58 41.91,44.19 43.93,46.2 43.93,68.18 44.26,68.51 50.41,68.51 51.12,69.21 v52.58,69.21
VCC_OPT3001  (via drill 0.51)
  Top 0.254: U5.5 32.43,67.44 C11.1 R9.2 31.99,66.17 31.48,65.66 31.48,62.61 28.69,59.82 v22.48,59.82 | U11.2 U11.1 5.99,48.51 C20.1 7.26,45.85 v8.37,45.85
  Bottom 0.254: v8.37,45.85 12.18,45.85 13.67,47.34 13.67,57.55 15.38,59.26 21.92,59.26 v22.48,59.82 22.48,60.47 TP5.TP
VCC_USB  (via drill 0.51)
  Top 0.254: LED11.A v9.89,59.31 | R7.2 13.81,66.25 12.37,64.81 C3.1 10.3,64.81 U2.4 10.08,65.72 9.89,65.91 v9.89,66.42 10.86,67.39 12.14,67.39 12.25,67.5 X1.1
  Bottom 0.254: v9.89,59.31 v9.89,66.42 10.65,67.18 TP3.TP
VCC_XBEE  (via drill 0.51)
  Top 0.254: R12.2 C18.1 40.05,67.44 U9.5 40.88,69.66 v40.88,75.56 | JP26.1 52.49,22.13 C57.1
  Bottom 0.254: TP7.TP 39.61,75.56 v40.88,75.56 41.96,76.64 75.88,76.64 77.53,74.99 77.53,49.77 78.49,48.82 78.49,32.45 72.56,26.53 68.32,26.53 63.96,22.17 59.58,22.17 58.2,23.55 56.19,23.55 JP26.1
  pour Top (isolate 0.305): 46.97,21.72 46.97,17.91 48.75,17.91 48.75,20.95 55.86,20.95 56.12,21.21 56.12,22.99 55.61,23.49 51.55,23.49 51.55,21.72
VCOM
  Top 0.254: U18.24 19.72,4.75 19.41,5.05 17.15,5.05 14.97,7.24 C40.1
VDD
  Top 0.254: U18.18 22.74,4.1 22.74,7.51 C1.1
VGH  (via drill 0.51)
  Top 0.254: v33,5.71 33.68,5.71 C45.1 | v29.33,6.22 29.22,6.11 U18.5
  Bottom 0.254: v29.33,6.22 32.5,6.22 v33,5.71
VGL  (via drill 0.51)
  Top 0.254: U18.4 29.72,3.03 v30.34,2.41 | C44.1 v35.8,2.67
  Bottom 0.254: v30.34,2.41 30.59,2.67 v35.8,2.67
VPP
  Top 0.254: U18.19 22.24,4.1 22.24,4.95 22.18,5.02 22.18,5.53 21.32,6.38 C2.1
VSH
  Top 0.254: C36.1 20.05,7.01 21.72,5.34 U18.20
VSL
  Top 0.254: U18.22 20.72,5.04 19.8,5.97 18.02,5.97 17.51,6.48 C39.1
XBEE_CTS
  Top 0.254: JP2.2 66.27,2.13 67.77,3.63 74.27,3.63 JP26.12
XBEE_DTR
  Top 0.254: JP2.3 58.84,2.06 JP26.9
XBEE_RESET  (via drill 0.51)
  Top 0.254: U12.26 22.47,27.33 22.27,27.13 v21.77,27.13 | v21.79,15.4 22.7,15.4 22.98,15.11 23.72,15.11 24.58,15.98 38.98,15.98 41.17,13.78 42.83,13.78 43.12,14.07 v44.24,14.07
  Bottom 0.254: v44.24,14.07 54.71,14.07 JP26.5 | v21.77,27.13 22.35,26.54 22.35,15.96 v21.79,15.4
XBEE_RTS
  Bottom 0.254: JP2.1 68.88,2.13 73.27,2.13 75.27,4.13 75.27,12.63 JP26.16

## Text on the board
Top: MASTERS PROJECT / REVISION 3.0
bPlace: Engineer: Sean Alling / Rev: 3.0